# Altium project RPI_HAT_AMP_TAS5756_02.PrjPcb
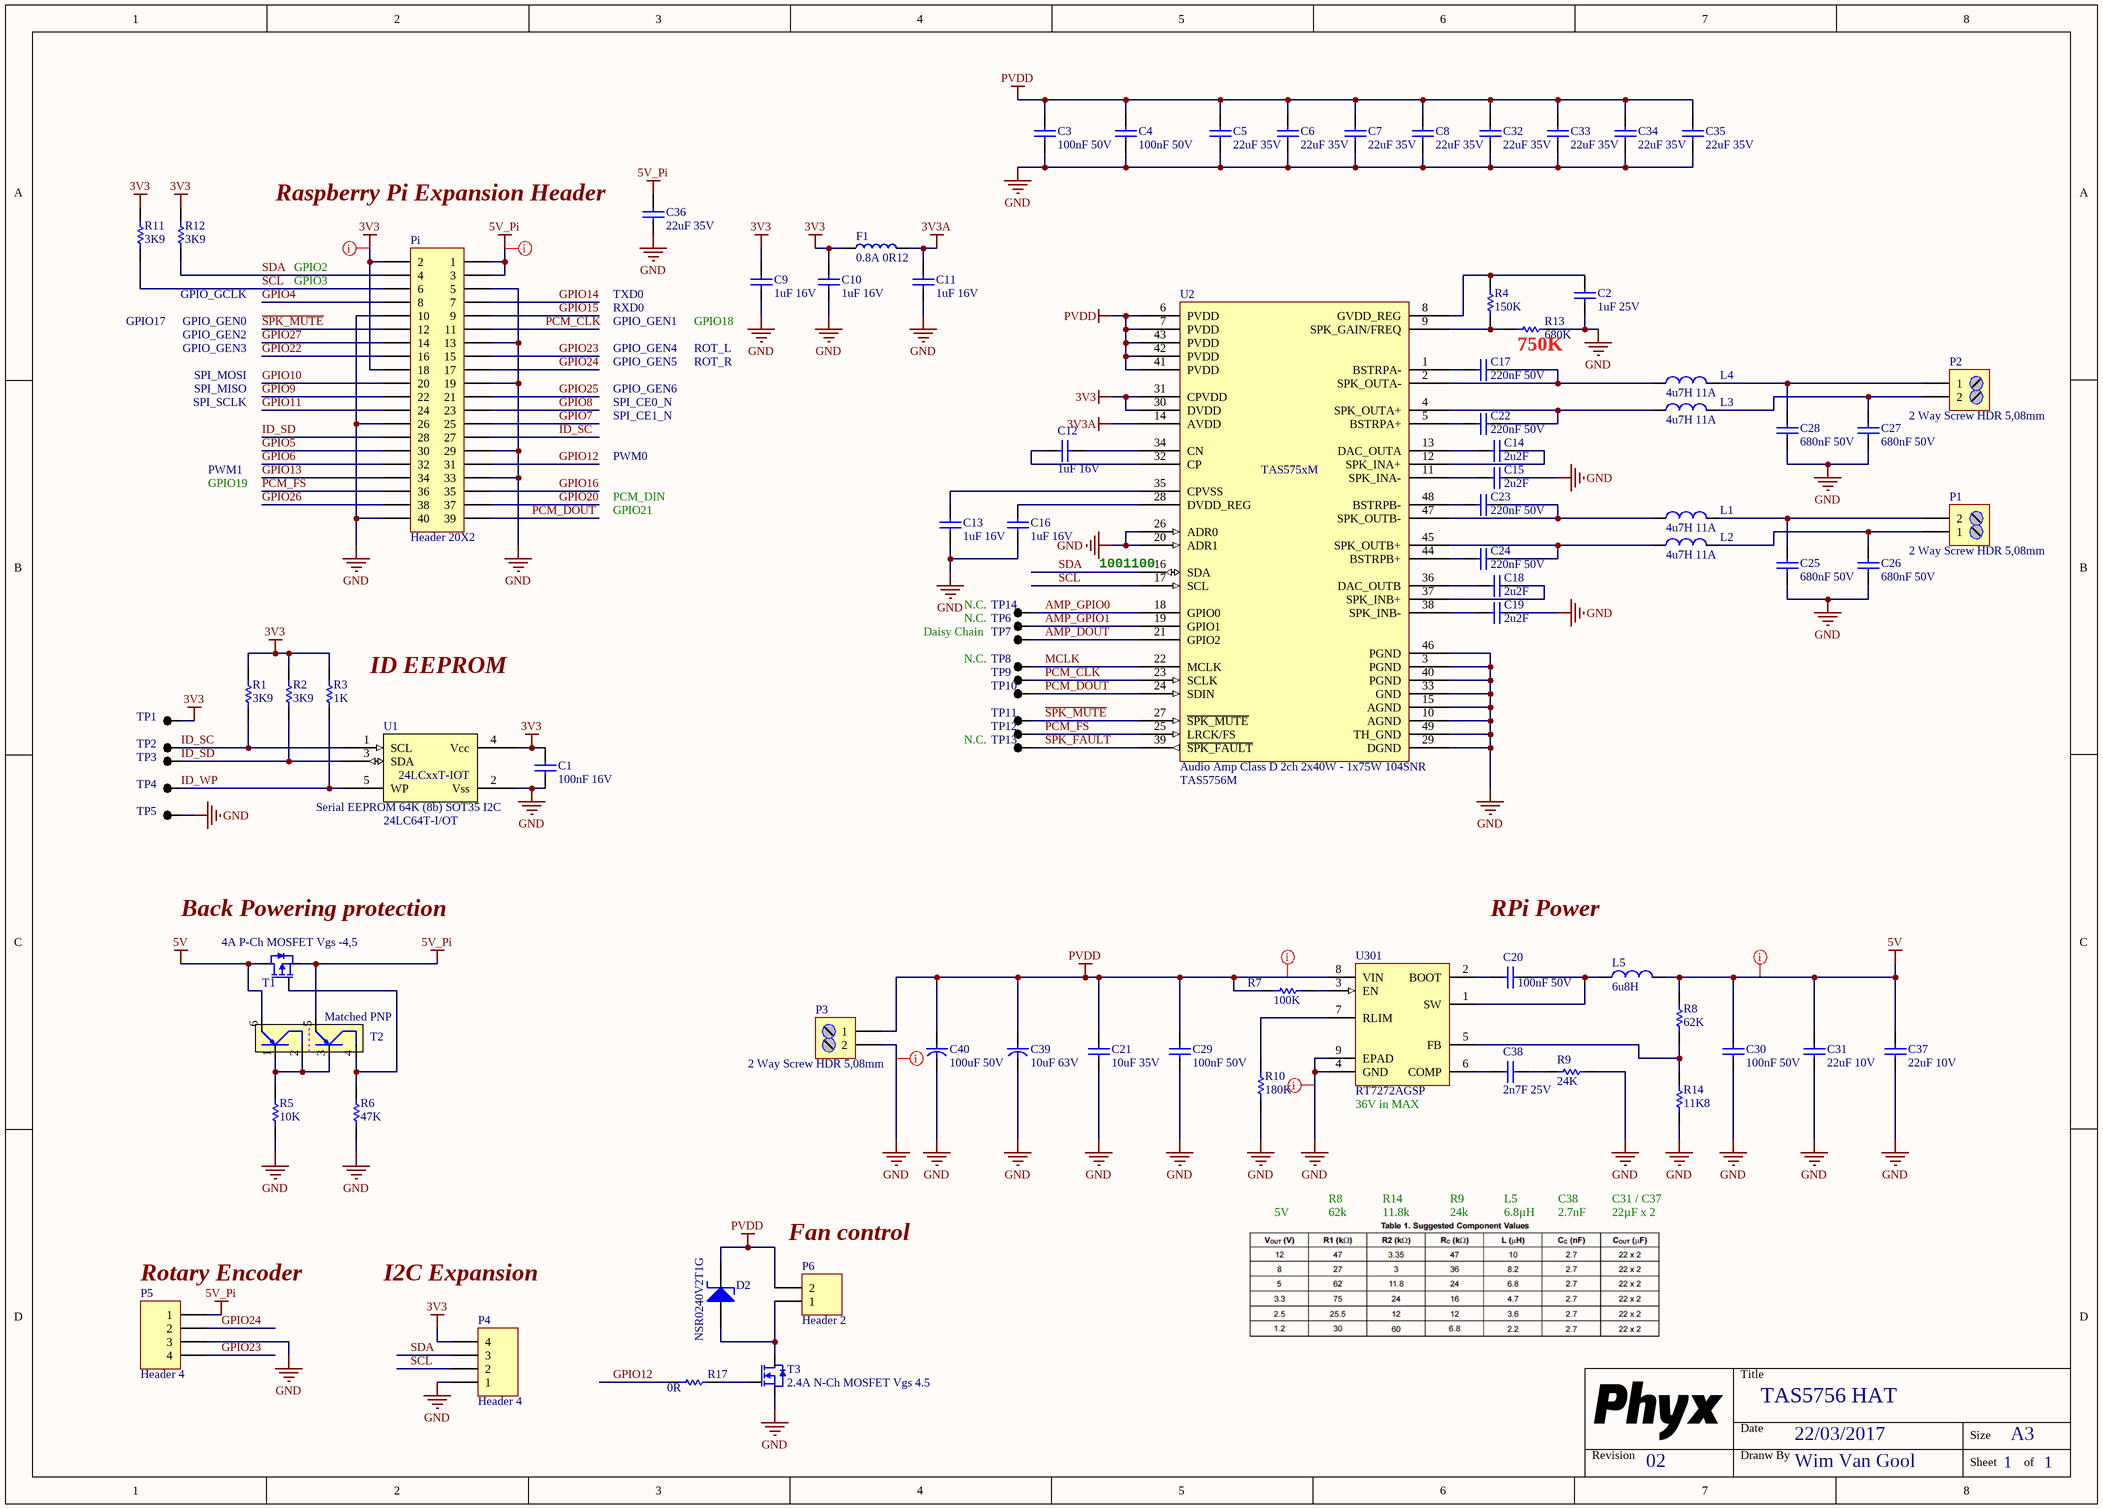
[diagram p0: RPI_HAT_AMP_TAS5756_02.SchDoc]
PCB_ENGINEER: WimVG; PCB_REV: 02; PCB_TITLE: TAS5756 HAT
1 sheet, 89 parts. Net scope: global (net labels, ports and power ports of the same name join across sheets).
Board file: RPI_HAT_AMP_TAS5756_02.PcbDoc

## Sheet RPI_HAT_AMP_TAS5756_02.SchDoc: TAS5756 HAT
size A3; Date: 22/03/2017; DrawnBy: Wim Van Gool; Revision: 02; SheetNumber: 1; SheetTotal: 1

### Parts
C1  value 100nF 16V  [C0603_N]  (hidden comment: CAP_CERAMIC)
C2  value 1uF 25V  [C0805_N]  (hidden comment: CAP_CERAMIC)
C3  value 100nF 50V  [C0805_N]  (hidden comment: CAP_CERAMIC)
C4  value 100nF 50V  [C0805_N]  (hidden comment: CAP_CERAMIC)
C5  value 22uF 35V  [C1206_N]  (hidden comment: CAP_CERAMIC)
C6  value 22uF 35V  [C1206_N]  (hidden comment: CAP_CERAMIC)
C7  value 22uF 35V  [C1206_N]  (hidden comment: CAP_CERAMIC)
C8  value 22uF 35V  [C1206_N]  (hidden comment: CAP_CERAMIC)
C9  value 1uF 16V  [C0603_N]  (hidden comment: CAP_CERAMIC)
C10  value 1uF 16V  [C0603_N]  (hidden comment: CAP_CERAMIC)
C11  value 1uF 16V  [C0603_N]  (hidden comment: CAP_CERAMIC)
C12  value 1uF 16V  [C0603_N]  (hidden comment: CAP_CERAMIC)
C13  value 1uF 16V  [C0603_N]  (hidden comment: CAP_CERAMIC)
C14  value 2u2F  [C0805_N]  (hidden comment: CAP_CERAMIC)
C15  value 2u2F  [C0805_N]  (hidden comment: CAP_CERAMIC)
C16  value 1uF 16V  [C0603_N]  (hidden comment: CAP_CERAMIC)
C17  value 220nF 50V  [C0805_N]  (hidden comment: CAP_CERAMIC)
C18  value 2u2F  [C0805_N]  (hidden comment: CAP_CERAMIC)
C19  value 2u2F  [C0805_N]  (hidden comment: CAP_CERAMIC)
C20  value 100nF 50V  [C0603_N]  (hidden comment: CAP_CERAMIC)
C21  value 10uF 35V  [C1206_N]  (hidden comment: CAP_CERAMIC)
C22  value 220nF 50V  [C0805_N]  (hidden comment: CAP_CERAMIC)
C23  value 220nF 50V  [C0805_N]  (hidden comment: CAP_CERAMIC)
C24  value 220nF 50V  [C0805_N]  (hidden comment: CAP_CERAMIC)
C25  value 680nF 50V  [C0805_N]  (hidden comment: CAP_CERAMIC)
C26  value 680nF 50V  [C0805_N]  (hidden comment: CAP_CERAMIC)
C27  value 680nF 50V  [C0805_N]  (hidden comment: CAP_CERAMIC)
C28  value 680nF 50V  [C0805_N]  (hidden comment: CAP_CERAMIC)
C29  value 100nF 50V  [C0603_N]  (hidden comment: CAP_CERAMIC)
C30  value 100nF 50V  [C0603_N]  (hidden comment: CAP_CERAMIC)
C31  value 22uF 10V  [C1210_N]  (hidden comment: CAP_CERAMIC)
C32  value 22uF 35V  [C1206_N]  (hidden comment: CAP_CERAMIC)
C33  value 22uF 35V  [C1206_N]  (hidden comment: CAP_CERAMIC)
C34  value 22uF 35V  [C1206_N]  (hidden comment: CAP_CERAMIC)
C35  value 22uF 35V  [C1206_N]  (hidden comment: CAP_CERAMIC)
C36  value 22uF 35V  [C1206_N]  (hidden comment: CAP_CERAMIC)
C37  value 22uF 10V  [C1210_N]  (hidden comment: CAP_CERAMIC)
C38  value 2n7F 25V  [C0603_N]  (hidden comment: CAP_CERAMIC)
C39  value 10uF 63V  [C_5x11_2mm]  (hidden comment: CAP_POL)
C40  value 100uF 50V  [C_8x11.5_3.5mm]  (hidden comment: CAP_POL)
D2  value NSR0240V2T1G  [ON_SOD-523]  (hidden comment: NSR0240V2T1G Schottky ULTRAFAST, 200MA, 40V)
F1  value 0.8A 0R12  [L0805]  (hidden comment: FERRITE)
L1  value 4u7H 11A  [XAL6060-472]  (hidden comment: XAL6060-472MEC)
L2  value 4u7H 11A  [XAL6060-472]  (hidden comment: XAL6060-472MEC)
L3  value 4u7H 11A  [XAL6060-472]  (hidden comment: XAL6060-472MEC)
L4  value 4u7H 11A  [XAL6060-472]  (hidden comment: XAL6060-472MEC)
L5  value 6u8H  [SNL_SWPA4020]  (hidden comment: SWPA4020S6R8MT)
P1  2 Way Screw HDR 5,08mm  [TERM_BLK-0508-2-90]
P2  2 Way Screw HDR 5,08mm  [TERM_BLK-0508-2-90]
P3  2 Way Screw HDR 5,08mm  [TERM_BLK-0508-2-90]
P4  Header 4  [HDR1X4]
P5  Header 4  [HDR1X4]
P6  Header 2  [HDR1X2]
Pi  Header 20X2  [RCPT2X20]
R1  value 3K9  [R0603_N]  (hidden comment: RESISTOR)
R2  value 3K9  [R0603_N]  (hidden comment: RESISTOR)
R3  value 1K  [R0603_N]  (hidden comment: RESISTOR)
R4  value 150K  [R0603_N]  (hidden comment: RESISTOR)
R5  value 10K  [R0603_N]  (hidden comment: RESISTOR)
R6  value 47K  [R0603_N]  (hidden comment: RESISTOR)
R7  value 100K  [R0603_N]  (hidden comment: RESISTOR)
R8  value 62K  [R0603_N]  (hidden comment: RESISTOR)
R9  value 24K  [R0603_N]  (hidden comment: RESISTOR)
R10  value 180K  [R0603_N]  (hidden comment: RESISTOR)
R11  value 3K9  [R0603_N]  (hidden comment: RESISTOR)
R12  value 3K9  [R0603_N]  (hidden comment: RESISTOR)
R13  value 680K  [R0603_N]  (hidden comment: RESISTOR)
R14  value 11K8  [R0603_N]  (hidden comment: RESISTOR)
R17  value 0R  [R0603_N]  (hidden comment: RESISTOR)
T1  4A P-Ch MOSFET Vgs -4,5  [SOT23-3]
T2  Matched PNP  [SOT23-6]
T3  2.4A N-Ch MOSFET Vgs 4.5  [SOT23-3]
TP1  TEST_PAD  [TP_1.2mm_0.6mm]  (value not drawn)
TP2  TEST_PAD  [TP_1.2mm_0.6mm]  (value not drawn)
TP3  TEST_PAD  [TP_1.2mm_0.6mm]  (value not drawn)
TP4  TEST_PAD  [TP_1.2mm_0.6mm]  (value not drawn)
TP5  TEST_PAD  [TP_1.2mm_0.6mm]  (value not drawn)
TP6  TEST_PAD  [TP_0.4mm]  (value not drawn)
TP7  TEST_PAD  [TP_1.2mm_0.6mm]  (value not drawn)
TP8  TEST_PAD  [TP_0.4mm]  (value not drawn)
TP9  TEST_PAD  [TP_0.4mm]  (value not drawn)
TP10  TEST_PAD  [TP_1.2mm_0.6mm]  (value not drawn)
TP11  TEST_PAD  [TP_0.4mm]  (value not drawn)
TP12  TEST_PAD  [TP_0.4mm]  (value not drawn)
TP13  TEST_PAD  [TP_0.4mm]  (value not drawn)
TP14  TEST_PAD  [TP_0.4mm]  (value not drawn)
U1  Serial EEPROM 64K (8b) SOT35 I2C  value 24LC64T-I/OT  [SOT23-5]
U2  Audio Amp Class D 2ch 2x40W - 1x75W 104SNR  value TAS5756M  [TI-DCA-R-PDSO-G48]
U301  value RT7272AGSP  [SOIC_N_8_TH]  (hidden comment: Buck 3A 36Vin sync)

### Nets
3V3: C1.1 C9.1 C10.1 F1.1 P4.4 Pi.2 Pi.18 R1.1 R2.1 R3.1 R11.1 R12.1 TP1.1 U1.4(Vcc) U2.30(DVDD) U2.31(CPVDD)
3V3A: C11.1 F1.2 U2.14(AVDD)
5V: C30.1 C31.1 C37.1 L5.2 R8.1 T1.3(D) T2.6(E)
5V_Pi: C36.1 P5.1 Pi.1 Pi.3 T1.2(S) T2.5(E)
GND: C1.2 C2.2 C3.2 C4.2 C5.2 C6.2 C7.2 C8.2 C9.2 C10.2 C11.2 C13.2 C15.1 C16.2 C19.1 C21.2 C25.1 C26.1 C27.1 C28.1 C29.2 C30.2 C31.2 C32.2 C33.2 C34.2 C35.2 C36.2 C37.2 C39.2 C40.2 P3.2 P4.1 P5.3 Pi.5 Pi.10 Pi.13 Pi.19 Pi.26 Pi.29 Pi.33 Pi.40 R5.2 R6.2 R9.2 R10.2 R13.1 R14.2 T3.2(S) TP5.1 U1.2(Vss) U2.3(PGND) U2.10(AGND) U2.15(AGND) U2.20(ADR1) U2.26(ADR0) U2.29(DGND) U2.33(GND) U2.40(PGND) U2.46(PGND) U2.49(TH_GND) U301.4(GND) U301.9(EPAD)
PVDD: C3.1 C4.1 C5.1 C6.1 C7.1 C8.1 C21.1 C29.1 C32.1 C33.1 C34.1 C35.1 C39.1 C40.1 D2.1(C) P3.1 P6.2 R7.2 U2.6(PVDD) U2.7(PVDD) U2.41(PVDD) U2.42(PVDD) U2.43(PVDD) U301.8(VIN)
AMP_DOUT: TP7.1 U2.21(GPIO2)
AMP_GPIO0: TP14.1 U2.18(GPIO0)
AMP_GPIO1: TP6.1 U2.19(GPIO1)
GPIO4: Pi.8
GPIO5: Pi.30
GPIO6: Pi.32
GPIO7: Pi.25
GPIO8: Pi.23
GPIO9: Pi.22
GPIO10: Pi.20
GPIO11: Pi.24
GPIO12: Pi.31 R17.2
GPIO13: Pi.34
GPIO14: Pi.7
GPIO15: Pi.9
GPIO16: Pi.35
GPIO20: Pi.37
GPIO22: Pi.16
GPIO23: P5.4 Pi.15
GPIO24: P5.2 Pi.17
GPIO25: Pi.21
GPIO26: Pi.38
GPIO27: Pi.14
ID_SC: Pi.27 R1.2 TP2.1 U1.1(SCL)
ID_SD: Pi.28 R2.2 TP3.1 U1.3(SDA)
ID_WP: R3.2 TP4.1 U1.5(WP)
MCLK: TP8.1 U2.22(MCLK)
PCM_CLK: Pi.11 TP9.1 U2.23(SCLK)
PCM_DOUT: Pi.39 TP10.1 U2.24(SDIN)
PCM_FS: Pi.36 TP12.1 U2.25(LRCK/FS)
~{SPK_FAULT}: TP13.1 U2.39(~{SPK_FAULT})
~{SPK_MUTE}: Pi.12 TP11.1 U2.27(~{SPK_MUTE})
SCL: P4.2 Pi.6 R11.2 U2.17(SCL)
SDA: P4.3 Pi.4 R12.2 U2.16(SDA)
NetC2_1: C2.1 R4.2 U2.8(GVDD_REG)
NetC12_1: C12.1 U2.32(CP)
NetC12_2: C12.2 U2.34(CN)
NetC13_1: C13.1 U2.35(CPVSS)
NetC14_1: C14.1 U2.13(DAC_OUTA)
NetC14_2: C14.2 U2.12(SPK_INA+)
NetC15_2: C15.2 U2.11(SPK_INA-)
NetC16_1: C16.1 U2.28(DVDD_REG)
NetC17_1: C17.1 L4.1 U2.2(SPK_OUTA-)
NetC17_2: C17.2 U2.1(BSTRPA-)
NetC18_1: C18.1 U2.36(DAC_OUTB)
NetC18_2: C18.2 U2.37(SPK_INB+)
NetC19_2: C19.2 U2.38(SPK_INB-)
NetC20_1: C20.1 U301.2(BOOT)
NetC20_2: C20.2 L5.1 U301.1(SW)
NetC22_1: C22.1 L3.1 U2.4(SPK_OUTA+)
NetC22_2: C22.2 U2.5(BSTRPA+)
NetC23_1: C23.1 L1.1 U2.47(SPK_OUTB-)
NetC23_2: C23.2 U2.48(BSTRPB-)
NetC24_1: C24.1 L2.1 U2.45(SPK_OUTB+)
NetC24_2: C24.2 U2.44(BSTRPB+)
NetC25_2: C25.2 L1.2 P1.2
NetC26_2: C26.2 L2.2 P1.1
NetC27_2: C27.2 L3.2 P2.2
NetC28_2: C28.2 L4.2 P2.1
NetC38_1: C38.1 R9.1
NetC38_2: C38.2 U301.6(COMP)
NetD2_2: D2.2(A) P6.1 T3.3(D)
NetR4_1: R4.1 R13.2 U2.9(SPK_GAIN/FREQ)
NetR5_1: R5.1 T2.1(B) T2.2(C) T2.3(B)
NetR6_1: R6.1 T1.1(G) T2.4(C)
NetR7_1: R7.1 U301.3(EN)
NetR8_2: R8.2 R14.1 U301.5(FB)
NetR10_1: R10.1 U301.7(RLIM)
NetR17_1: R17.1 T3.1(G)

### Layout directives
net class POWER: 3V3, 5V, 5V_Pi, GND, PVDD

### Notes on the sheet
- (near C36) Raspberry Pi Expansion Header
- GPIO_GCLK
- GPIO2
- GPIO3
- TXD0
- RXD0
- GPIO17
- GPIO_GEN0
- GPIO_GEN2
- GPIO_GEN3
- SPI_MOSI
- GPIO_GEN1
- GPIO_GEN4
- GPIO_GEN5
- (near C9) GPIO18
- ROT_R
- ROT_L
- (near R13) 750K
- SPI_MISO
- SPI_SCLK
- GPIO_GEN6
- SPI_CE0_N
- SPI_CE1_N
- GPIO19
- PWM1
- PCM_DIN
- GPIO21
- PWM0
- (near U2) 1001100
- Daisy Chain
- N.C.
- (near R3) ID EEPROM
- (near T1) Back Powering protection
- RPi Power
- (near U301) 36V in MAX
- (near P6) Fan control
- 5V
- 62k
- R8
- 11.8k
- R14
- 24k
- R9
- 6.8µH
- L5
- 2.7nF
- C38
- 22µF x 2
- C31 / C37
- (near P5) Rotary Encoder
- I2C Expansion
- Title
- Revision
- Date
- Dranw By
- Size
- A3
- Sheet
- of

### Library data of the parts
C1 = CAP # 100nF 16V 0603: Capacitor Ceramic
C2 = CAP # 1uF 25V 0805: Capacitor Ceramic; Supplier 1: Farnell; Supplier Part Number 1: 2395779
C3 C4 = CAP # 100nF 50V 0805: Capacitor Ceramic; Supplier 1: Farnell; Supplier Part Number 1: 1759265
C5-C8 C32-C36 = CAP # 22uF 35V 1206 X5R: Capacitor Ceramic; Supplier 1: Digikey; Supplier Part Number 1: 445-8045-1-ND
C9-C13 C16 = CAP # 1uF 16V 0603: Capacitor Ceramic; Supplier 1: Farnell; Supplier Part Number 1: 2320814
C14 C15 C18 C19 = CAP # 2u2F 25V 0805: Capacitor Ceramic; Supplier 1: Farnell; Supplier Part Number 1: 2320829
C17 C22-C24 = CAP # 220nF 50V 0805: Capacitor Ceramic; Supplier 1: Farnell; Supplier Part Number 1: 2320842
C20 C29 C30 = CAP # 100nF 50V 0603: Capacitor Ceramic; Supplier 1: Farnell; Supplier Part Number 1: 1759122
C21 = CAP # 10uF 35V 1206 X5R: Capacitor Ceramic; Supplier 1: Farnell; Supplier Part Number 1: 1797011; Description: CAP # 10uF 35V 1206 X5R
C25-C28 = CAP # 680nF 50V 0805: Capacitor Ceramic; Supplier 1: Farnell; Supplier Part Number 1: 2210987
C31 C37 = CAP # 22uF 10V 1210 X5R: Capacitor Ceramic
C38 = CAP # 2n7F 25V 0603: Capacitor Ceramic
C39 = CAP 10uF 63V 5x11mm: Capacitor electrolyt; Description: CAP 10uF 63V 5x11mm; Supplier 1: Farnell; Supplier Part Number 1: 2079130
C40 = CAP 100uF 50V 8x11mm: Capacitor electrolyt; Description: CAP 100uF 50V 8x11mm; Supplier 1: Farnell; Supplier Part Number 1: 9693793
D2 = Schottky NSR0240V2T1G: =Description; Supplier 1: Farnell; Supplier Part Number 1: 2317403
F1 = FER # 120R 0.8A 0805 0R12: Supplier 1: Farnell; Supplier Part Number 1: 1669728
L1-L4 = IND # 4u7H 11A: Supplier 1: Farnell; Supplier Part Number 1: 2289085
L5 = IND # 6u8H SWPA4020: Supplier 1: China; Supplier Part Number 1: SWPA4020S6R8MT
P1-P3 = Terminal Block 5,08mm 2way: Value: PM5.08/2/90; Supplier 1: Farnell
P4 P5 = Pin Header 2.54mm 4way
P6 = Pin Header 2.54mm 2way
Pi = Receptable 2.54mm dual row 40way: =Description
R1 R2 R11 R12 = RES # 3K9 0603
R3 = RES # 1K 0603
R4 = RES # 150K 0603
R5 = RES # 10K 0603
R6 = RES # 47K 0603
R7 = RES # 100K 0603
R8 = RES # 62K 0603
R9 = RES # 24K 0603
R10 = RES # 180K 0603
R13 = RES # 680K 0603
R14 = RES # 11K8 0603
R17 = RES # 0R 0603
T1 = TSM2311CX P-Ch MOSFET 4A: =Description; Value: TSM2311CX; Supplier 1: Farnell; Supplier Part Number 1: 1864586
T2 = DMMT5401-7-F matched PNP: Value: DMMT5401-7-F; Supplier 1: Farnell; Supplier Part Number 1: 1773583
T3 = ZXMN2B01F N-Ch MOSFET 2.4A 4.5Vgs 30Vds: Value: ZXMN2B01F; Supplier 1: Farnell; Supplier Part Number 1: 1426253
TP1-TP5 TP7 TP10 = TP 1.2mm: Value: NO BOM
TP6 TP8 TP9 TP11-TP14 = TP # 0.4mm: Value: NO BOM
U1 = EEPROM # I2C 8Kx8b 24LC64T-I/OT: =Description; Supplier 1: Farnell; Supplier Part Number 1: 1700992
U2 = AMP # AUD TAS5756M: =Description
U301 = PWR # Buck RT7272A SOP8: =Description; Supplier 1: China; Supplier Part Number 1: RT7272AGSP

## Assembly variants
A: not fitted C29 P4 R11 R12 R16 TP1 TP2 TP3 TP4 TP5 TP6 TP7 TP8 TP9 TP10 TP11 TP12 TP13
B: not fitted C21 C29 D1 P4 R5 R6 R7 R8 R9 R10 R11 R12 R17 T1 T2 TP1 TP2 TP3 TP4 TP5 TP6 TP7 TP8 TP9 TP10 TP11 TP12 TP13 U3